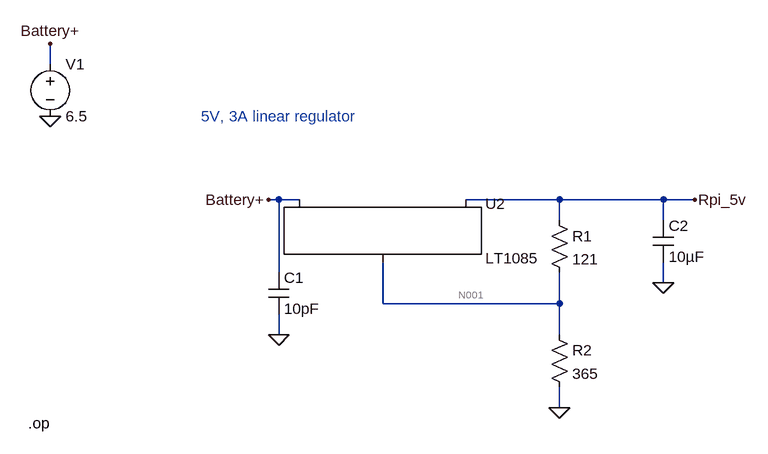
[diagram p0: schematic rpi_hat.asc]
rpi_hat.asc, the LTspice schematic file:
Version 4
SHEET 1 2008 680
WIRE -864 -992 -864 -1024
WIRE -512 -784 -528 -784
WIRE -480 -784 -512 -784
WIRE -80 -784 -224 -784
WIRE 80 -784 -80 -784
WIRE 128 -784 80 -784
WIRE -80 -752 -80 -784
WIRE 80 -752 80 -784
WIRE -512 -672 -512 -784
WIRE 80 -656 80 -688
WIRE -352 -624 -352 -688
WIRE -80 -624 -80 -672
WIRE -80 -624 -352 -624
WIRE -512 -576 -512 -608
WIRE -80 -576 -80 -624
WIRE -80 -464 -80 -496
FLAG -864 -912 0
FLAG -864 -1024 Battery+
FLAG -528 -784 Battery+
FLAG -80 -464 0
FLAG 80 -656 0
FLAG -512 -576 0
FLAG 128 -784 Rpi_5v
SYMBOL PowerProducts\\LT1085 -352 -784 R0
SYMATTR InstName U2
SYMBOL voltage -864 -1008 R0
WINDOW 123 0 0 Left 0
WINDOW 39 0 0 Left 0
SYMATTR InstName V1
SYMATTR Value 6.5
SYMBOL res -96 -768 R0
SYMATTR InstName R1
SYMATTR Value 121
SYMBOL res -96 -592 R0
SYMATTR InstName R2
SYMATTR Value 365
SYMBOL cap -528 -672 R0
SYMATTR InstName C1
SYMATTR Value 10pF
SYMBOL cap 64 -752 R0
SYMATTR InstName C2
SYMATTR Value 10µF
TEXT -632 -912 Left 2 ;5V, 3A linear regulator
TEXT -898 -440 Left 2 !.op

The netlist it stands for:
* rpi_hat.asc
XU2 N001 Rpi_5v Battery+ LT1085
V1 Battery+ 0 6.5
R1 Rpi_5v N001 121
R2 N001 0 365
C1 Battery+ 0 10pF
C2 Rpi_5v 0 10µF
* 5V, 3A linear regulator
.op
.backanno
.end

* Results of the author's LTspice run, read from the files saved beside the schematic
* Operating Point:
*   V(rpi_5v) = 5.005 V
*   V(n001) = 3.764 V
*   V(battery+) = 6.5 V
*   I(C2) = 0 A
*   I(C1) = 0 A
*   I(R2) = 10.31 mA
*   I(R1) = 10.26 mA
*   I(V1) = -10.31 mA
*   Ix(u2:1) = -56.98 µA
*   Ix(u2:2) = -10.26 mA
*   Ix(u2:3) = 10.31 mA
* From the log:
*   Semiconductor Device Operating Points:
*                           --- Diodes ---
*   Name:    d:u2:2      d:u2:3      d:u2:1
*   Model:   u2:2ma       u2:d        u2:d
*   Id:      1.99e-03   -7.74e-13   -6.77e-13
*   Vd:      1.49e+00   -7.73e-01   -6.77e-01
*   Req:     4.00e-03    1.00e-12    1.00e-12
*   CAP:     0.00e+00    0.00e+00    0.00e+00
*                           --- Bipolar Transistors ---
*   Name:     q:u2:12     q:u2:7      q:u2:3      q:u2:1
*   Model:     u2:pa       u2:na       u2:np       u2:n
*   Ib:      -3.40e-05    5.23e-07    4.53e-06    4.36e-07
*   Ic:      -2.72e-03    6.54e-05    5.44e-03    5.45e-05
*   Vbe:     -8.00e-01    7.04e-01    8.18e-01    1.24e+00
*   Vbc:      1.79e-02   -7.73e-01   -6.77e-01   -7.22e-01
*   Vce:     -8.18e-01    1.48e+00    1.49e+00    1.96e+00
*   BetaDC:   8.00e+01    1.25e+02    1.20e+03    1.25e+02
*   Gm:       1.05e-01    2.53e-03    2.10e-01    2.11e-03
*   Rpi:      7.60e+02    4.94e+04    5.71e+03    5.93e+04
*   Rx:       0.00e+00    0.00e+00    0.00e+00    0.00e+00
*   Ro:       5.16e+14    2.47e+27    5.94e+25    3.38e+26
*   Cbe:      0.00e+00    0.00e+00    0.00e+00    0.00e+00
*   Cbc:      0.00e+00    0.00e+00    0.00e+00    3.20e-11
*   Cjs:      0.00e+00    0.00e+00    0.00e+00    0.00e+00
*   BetaAC:   8.00e+01    1.25e+02    1.20e+03    1.25e+02
*   Cbx:      0.00e+00    0.00e+00    0.00e+00    0.00e+00
*   Ft:       0.00e+00    0.00e+00    0.00e+00    1.05e+07